# Altium schematic sheet CW340_SAM3X_MAIN.SchDoc: Control MCU Main
size Letter; Organization: NewAE Technology Inc.; Address1: 1083 Queen St., Suite 196; Address2: Halifax; Address3: NS; Address4: Canada B3H 0B2; DocumentNumber: .; Revision: .; SheetNumber: 5; SheetTotal: 31; SheetApproved: No
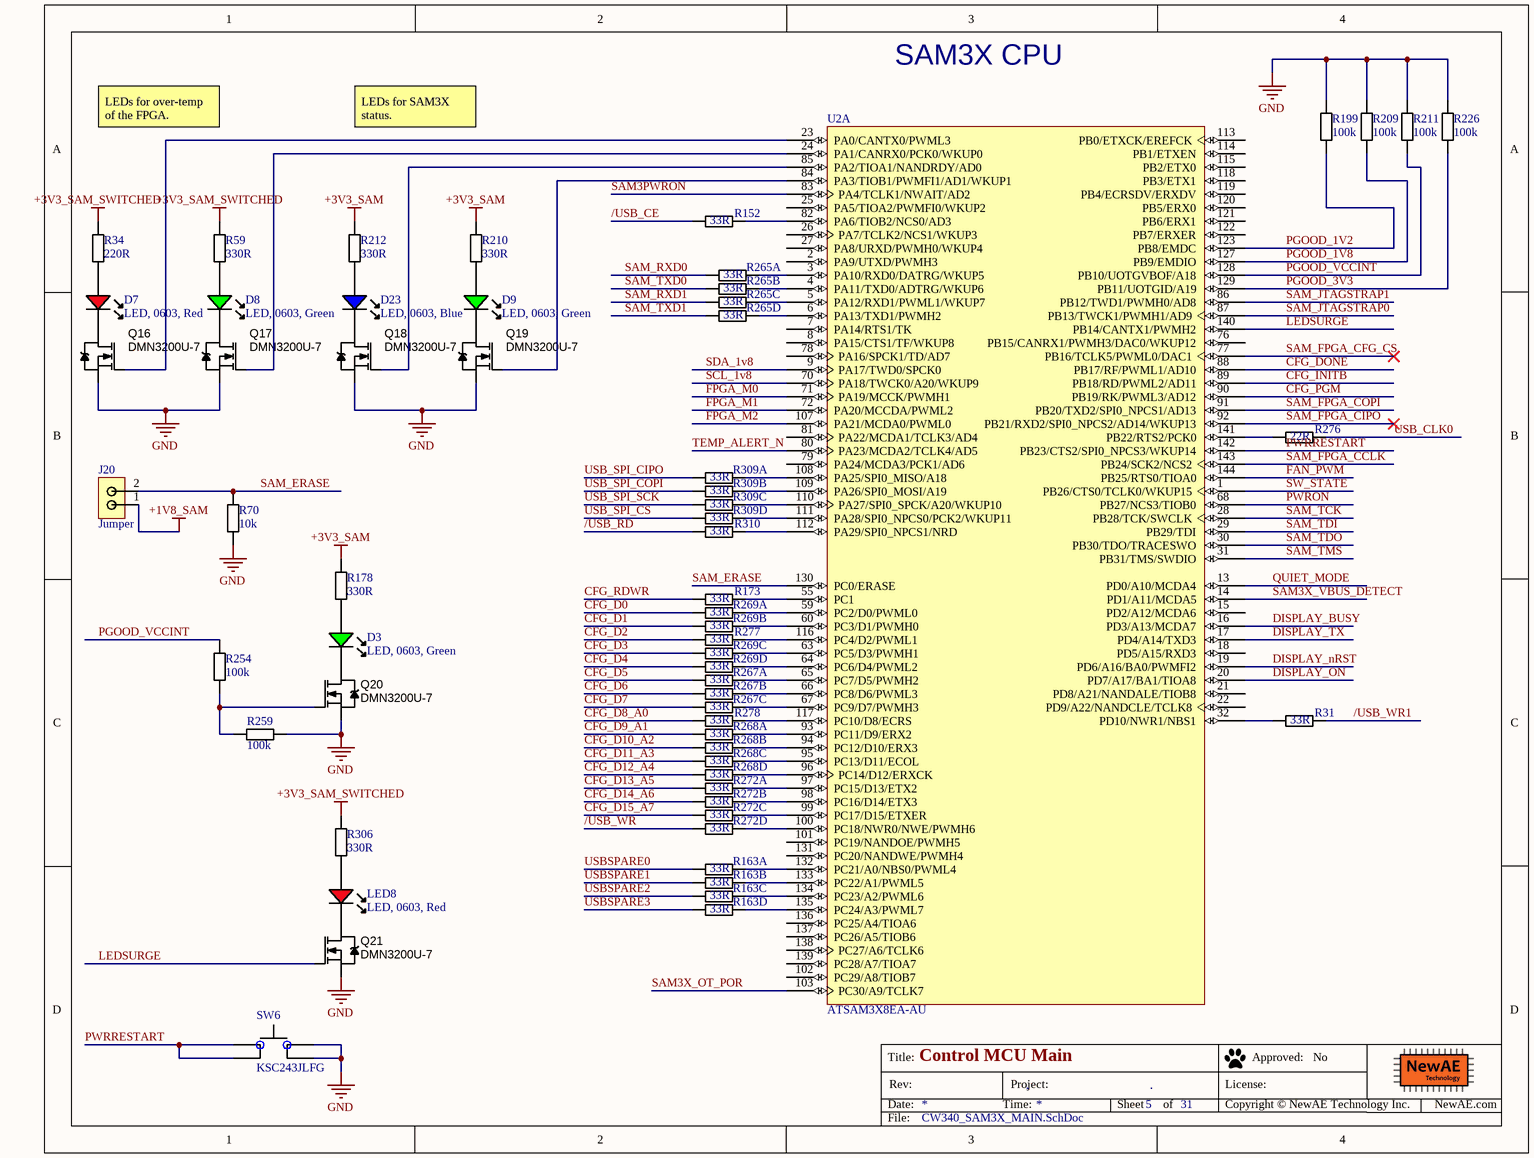
[diagram p0: CW340_SAM3X_MAIN.SchDoc]

## Parts
D3  LED, 0603, Green  [LED-0603-GREEN]
D7  LED, 0603, Red  [LED-0603-RED]
D8  LED, 0603, Green  [LED-0603-GREEN]
D9  LED, 0603, Green  [LED-0603-GREEN]
D23  LED, 0603, Blue  [LED-0603-BLUE]
J20  Jumper  [2x2.54mm_Header]
LED8  LED, 0603, Red  [LED-0603-RED]
Q16  DMN3200U-7  [SOT95P245X110-3M]
Q17  DMN3200U-7  [SOT95P245X110-3M]
Q18  DMN3200U-7  [SOT95P245X110-3M]
Q19  DMN3200U-7  [SOT95P245X110-3M]
Q20  DMN3200U-7  [SOT95P245X110-3M]
Q21  DMN3200U-7  [SOT95P245X110-3M]
R31  33R  [RESC1005X40N]
R34  220R  [RESC1608X55N]
R59  330R  [RESC1608X55N]
R70  10k  [RESC1005X40N]
R152  33R  [RESC1005X40N]
R163  33R  [741C083]  (parts A,B,C,D of 4)
R173  33R  [RESC1005X40N]
R178  330R  [RESC1608X55N]
R199  100k  [RESC1608X55N]
R209  100k  [RESC1608X55N]
R210  330R  [RESC1608X55N]
R211  100k  [RESC1608X55N]
R212  330R  [RESC1608X55N]
R226  100k  [RESC1608X55N]
R254  100k  [RESC1608X55N]
R259  100k  [RESC1608X55N]
R265  33R  [741C083]  (parts A,B,C,D of 4)
R267  33R  [741C083]  (parts A,B,C of 4)
R268  33R  [741C083]  (parts A,B,C,D of 4)
R269  33R  [741C083]  (parts A,B,C,D of 4)
R272  33R  [741C083]  (parts A,B,C,D of 4)
R276  22R  [RESC1005X40N]
R277  33R  [RESC1005X40N]
R278  33R  [RESC1005X40N]
R306  330R  [RESC1608X55N]
R309  33R  [741C083]  (parts A,B,C,D of 4)
R310  33R  [RESC1005X40N]
SW6  KSC243JLFG  [CK_KSC2J]
U2  ATSAM3X8EA-AU  [LQFP144_L]  (part A of 3)

## Nets
+1V8_SAM: J20.1
+3V3_SAM: R178.2 R210.2 R212.2
+3V3_SAM_SWITCHED: R34.2 R59.2 R306.2
GND: Q16.2(S) Q17.2(S) Q18.2(S) Q19.2(S) Q20.2(S) Q21.2(S) R70.2 R199.1 R209.1 R211.1 R226.1 R259.2 SW6.2(IN) SW6.3(IN)
/USB_CE: R152.1
/USB_RD: R310.1
/USB_WR: R272.4A
/USB_WR1: R31.2
CFG_D0: R269.1A
CFG_D1: R269.2A
CFG_D2: R277.1
CFG_D3: R269.3A
CFG_D4: R269.4A
CFG_D5: R267.1A
CFG_D6: R267.2A
CFG_D7: R267.3A
CFG_D8_A0: R278.1
CFG_D9_A1: R268.1A
CFG_D10_A2: R268.2A
CFG_D11_A3: R268.3A
CFG_D12_A4: R268.4A
CFG_D13_A5: R272.1A
CFG_D14_A6: R272.2A
CFG_D15_A7: R272.3A
CFG_DONE: U2.88(PB17/RF/PWML1/AD10)
CFG_INITB: U2.89(PB18/RD/PWML2/AD11)
CFG_PGM: U2.90(PB19/RK/PWML3/AD12)
CFG_RDWR: R173.1
DISPLAY_BUSY: U2.16(PD3/A13/MCDA7)
DISPLAY_nRST: U2.19(PD6/A16/BA0/PWMFI2)
DISPLAY_ON: U2.20(PD7/A17/BA1/TIOA8)
DISPLAY_TX: U2.17(PD4/A14/TXD3)
FAN_PWM: U2.144(PB25/RTS0/TIOA0)
FPGA_M0: U2.71(PA19/MCCK/PWMH1)
FPGA_M1: U2.72(PA20/MCCDA/PWML2)
FPGA_M2: U2.107(PA21/MCDA0/PWML0)
LEDSURGE: Q21.1(G) U2.140(PB14/CANTX1/PWMH2)
PGOOD_1V2: R199.2 U2.123(PB8/EMDC)
PGOOD_1V8: R209.2 U2.127(PB9/EMDIO)
PGOOD_3V3: R226.2 U2.129(PB11/UOTGID/A19)
PGOOD_VCCINT: R211.2 R254.1 U2.128(PB10/UOTGVBOF/A18)
PWRON: U2.68(PB27/NCS3/TIOB0)
PWRRESTART: SW6.1(IN) SW6.4(IN) U2.142(PB23/CTS2/SPI0_NPCS3/WKUP14)
QUIET_MODE: U2.13(PD0/A10/MCDA4)
SAM3PWRON: U2.83(PA4/TCLK1/NWAIT/AD2)
SAM3X_OT_POR: U2.103(PC30/A9/TCLK7)
SAM3X_VBUS_DETECT: U2.14(PD1/A11/MCDA5)
SAM_ERASE: J20.2 R70.1 U2.130(PC0/ERASE)
SAM_FPGA_CCLK: U2.143(PB24/SCK2/NCS2)
SAM_FPGA_CFG_CS: U2.77(PB16/TCLK5/PWML0/DAC1)
SAM_FPGA_CIPO: U2.92(PB21/RXD2/SPI0_NPCS2/AD14/WKUP13)
SAM_FPGA_COPI: U2.91(PB20/TXD2/SPI0_NPCS1/AD13)
SAM_JTAGSTRAP0: U2.87(PB13/TWCK1/PWMH1/AD9)
SAM_JTAGSTRAP1: U2.86(PB12/TWD1/PWMH0/AD8)
SAM_RXD0: R265.1A
SAM_RXD1: R265.3A
SAM_TCK: U2.28(PB28/TCK/SWCLK)
SAM_TDI: U2.29(PB29/TDI)
SAM_TDO: U2.30(PB30/TDO/TRACESWO)
SAM_TMS: U2.31(PB31/TMS/SWDIO)
SAM_TXD0: R265.2A
SAM_TXD1: R265.4A
SCL_1v8: U2.70(PA18/TWCK0/A20/WKUP9)
SDA_1v8: U2.9(PA17/TWD0/SPCK0)
SW_STATE: U2.1(PB26/CTS0/TCLK0/WKUP15)
TEMP_ALERT_N: U2.80(PA23/MCDA2/TCLK4/AD5)
USB_CLK0: R276.2
USB_SPI_CIPO: R309.1A
USB_SPI_COPI: R309.2A
USB_SPI_CS: R309.4A
USB_SPI_SCK: R309.3A
USBSPARE0: R163.1A
USBSPARE1: R163.2A
USBSPARE2: R163.3A
USBSPARE3: R163.4A
NetD3_A: D3.A R178.1
NetD3_K: D3.K Q20.3(D)
NetD7_A: D7.A R34.1
NetD7_K: D7.K Q16.3(D)
NetD8_A: D8.A R59.1
NetD8_K: D8.K Q17.3(D)
NetD9_A: D9.A R210.1
NetD9_K: D9.K Q19.3(D)
NetD23_A: D23.A R212.1
NetD23_K: D23.K Q18.3(D)
NetLED8_A: LED8.A R306.1
NetLED8_K: LED8.K Q21.3(D)
NetQ16_1: Q16.1(G) U2.23(PA0/CANTX0/PWML3)
NetQ17_1: Q17.1(G) U2.24(PA1/CANRX0/PCK0/WKUP0)
NetQ18_1: Q18.1(G) U2.85(PA2/TIOA1/NANDRDY/AD0)
NetQ19_1: Q19.1(G) U2.84(PA3/TIOB1/PWMFI1/AD1/WKUP1)
NetQ20_1: Q20.1(G) R254.2 R259.1
NetR31_1: R31.1 U2.32(PD10/NWR1/NBS1)
NetR152_2: R152.2 U2.82(PA6/TIOB2/NCS0/AD3)
NetR163_1B: R163.1B U2.132(PC21/A0/NBS0/PWML4)
NetR163_2B: R163.2B U2.133(PC22/A1/PWML5)
NetR163_3B: R163.3B U2.134(PC23/A2/PWML6)
NetR163_4B: R163.4B U2.135(PC24/A3/PWML7)
NetR173_2: R173.2 U2.55(PC1)
NetR265_1B: R265.1B U2.3(PA10/RXD0/DATRG/WKUP5)
NetR265_2B: R265.2B U2.4(PA11/TXD0/ADTRG/WKUP6)
NetR265_3B: R265.3B U2.5(PA12/RXD1/PWML1/WKUP7)
NetR265_4B: R265.4B U2.6(PA13/TXD1/PWMH2)
NetR267_1B: R267.1B U2.65(PC7/D5/PWMH2)
NetR267_2B: R267.2B U2.66(PC8/D6/PWML3)
NetR267_3B: R267.3B U2.67(PC9/D7/PWMH3)
NetR268_1B: R268.1B U2.93(PC11/D9/ERX2)
NetR268_2B: R268.2B U2.94(PC12/D10/ERX3)
NetR268_3B: R268.3B U2.95(PC13/D11/ECOL)
NetR268_4B: R268.4B U2.96(PC14/D12/ERXCK)
NetR269_1B: R269.1B U2.59(PC2/D0/PWML0)
NetR269_2B: R269.2B U2.60(PC3/D1/PWMH0)
NetR269_3B: R269.3B U2.63(PC5/D3/PWMH1)
NetR269_4B: R269.4B U2.64(PC6/D4/PWML2)
NetR272_1B: R272.1B U2.97(PC15/D13/ETX2)
NetR272_2B: R272.2B U2.98(PC16/D14/ETX3)
NetR272_3B: R272.3B U2.99(PC17/D15/ETXER)
NetR272_4B: R272.4B U2.100(PC18/NWR0/NWE/PWMH6)
NetR276_1: R276.1 U2.141(PB22/RTS2/PCK0)
NetR277_2: R277.2 U2.116(PC4/D2/PWML1)
NetR278_2: R278.2 U2.117(PC10/D8/ECRS)
NetR309_1B: R309.1B U2.108(PA25/SPI0_MISO/A18)
NetR309_2B: R309.2B U2.109(PA26/SPI0_MOSI/A19)
NetR309_3B: R309.3B U2.110(PA27/SPI0_SPCK/A20/WKUP10)
NetR309_4B: R309.4B U2.111(PA28/SPI0_NPCS0/PCK2/WKUP11)
NetR310_2: R310.2 U2.112(PA29/SPI0_NPCS1/NRD)

Not connected (* = marked no-connect by the designer): U2 2(PA9/UTXD/PWMH3) 7(PA14/RTS1/TK) 8(PA15/CTS1/TF/WKUP8) 15(PD2/A12/MCDA6) 18(PD5/A15/RXD3) 21(PD8/A21/NANDALE/TIOB8) 22(PD9/A22/NANDCLE/TCLK8) 25(PA5/TIOA2/PWMFI0/WKUP2) 26(PA7/TCLK2/NCS1/WKUP3) 27(PA8/URXD/PWMH0/WKUP4) 76(PB15/CANRX1/PWMH3/DAC0/WKUP12) 78(PA16/SPCK1/TD/AD7) 79(PA24/MCDA3/PCK1/AD6) 81(PA22/MCDA1/TCLK3/AD4) 101(PC19/NANDOE/PWMH5) 102(PC29/A8/TIOB7) 113(PB0/ETXCK/EREFCK) 114(PB1/ETXEN) 115(PB2/ETX0) 118(PB3/ETX1) 119(PB4/ECRSDV/ERXDV) 120(PB5/ERX0) 121(PB6/ERX1) 122(PB7/ERXER) 131(PC20/NANDWE/PWMH4) 136(PC25/A4/TIOA6) 137(PC26/A5/TIOB6) 138(PC27/A6/TCLK6) 139(PC28/A7/TIOA7)

## Notes on the sheet
- SAM3X CPU
- LEDs for over-temp of the FPGA.
- LEDs for SAM3X status.
- Title:
- Date:
- Rev:
- Time:
- Project:
- Sheet
- of
- License:
- Copyright © NewAE Technology Inc.
- Approved:
- NewAE.com
- File:

## Library data of the parts
D3 D8 D9 = LEDCHIP_0603_GREEN: Chip LED, Green; Manufacture 1: Kingbright; Manufacture Part Number 1: APT1608CGCK; Component Group: Optical; PP Material Stack: 16; PP Rotation: -90; Part Number: LEDCHIP_0603_GREEN; Pin Count: 2; Supplier 1: Digi-Key; Supplier Part Number 1: 754-1116-1-ND; Mounting Technology: SMT; Component Kind: Standard; Component Type: Standard
D7 LED8 = LEDCHIP_0603_RED: Chip LED, Red; Manufacture 1: Kingbright; Manufacture Part Number 1: APT1608SRCPRV; Component Group: Optical; PP Material Stack: 15; PP Rotation: -90; Part Number: LEDCHIP_0603_RED; Pin Count: 2; Supplier 1: Digi-Key; Supplier Part Number 1: 754-1122-1-ND; Mounting Technology: SMT; Component Kind: Standard; Component Type: Standard
D23 = LEDCHIP_0603_BLUE: Chip LED, Blue; Manufacture 1: Kingbright; Manufacture Part Number 1: APT1608QBC/D; Component Group: Optical; Part Number: LEDCHIP_0603_BLUE; Pin Count: 2; Mounting Technology: SMT; Component Kind: Standard; Component Type: Standard
J20 = 2_PIN_JUMPER: 1x2 2.54mm header, male pins; Manufacture 1: Harwin; Manufacture Part Number 1: M20-9990246; Component Group: PCB Feature; PP Material Stack: 0; Part Number: 2_PIN_JUMPER; Pin Count: 2; Supplier 1: Digi-Key; Supplier Part Number 1: 952-2262-ND; Mounting Technology: Through-hole; RoHS: Yes; Component Kind: Standard; Component Type: Standard; PP Rotation: 0
Q16-Q21 = DMN3200U-7: MOSFET N-CH 30V 2.2A SOT23-3; Manufacture 1: Diodes Inc.; Rated Power: 3A; PP Material Stack: 0; Part Number: DMN3200U-7; Component Group: MOSFET; Footprint: SOT23; Manufacture Part Number 1: DMN3200U-7; Pin Count: 3; Supplier 1: Digi-Key; Supplier Part Number 1: DMN3200U-7DICT-ND; Rated Voltage: 30V; Mounting Technology: SMT; RoHS: Yes; Component Kind: Standard; Component Type: Standard; PP Rotation: 0
R31 R152 R173 R277 R278 R310 = RCHIP-33R-0402: 33R res, 0402, 1%, 1/16W; Manufacture 1: Yageo; Manufacture Part Number 1: RC0402FR-0733RL; Component Group: Resistor; Case-EIA: 0402; Case-Metric: 1005; Rated Power: 0.063W; Rated Voltage: 75VDC; Part Number: RCHIP-33R-0402; Footprint: 0402; Pin Count: 2; Supplier 1: Digi-Key; Supplier Part Number 1: 311-33.0LRCT-ND; Value: 33R; Tolerance: 1%; Mounting Technology: SMT; Temperature Range: -55C to 155C; Component Kind: Standard; Component Type: Standard
R34 = RCHIP-220R-0603: 220R res, 0603, 1%, 1/10W; Manufacture 1: Yageo; Manufacture Part Number 1: RC0603FR-07220RL; Component Group: Resistor; Case-EIA: 0603; Case-Metric: 1608; Rated Power: 0.1W; Rated Voltage: 75VDC; Part Number: RCHIP-220R-0603; Footprint: 0603; Pin Count: 2; Supplier 1: Digi-Key; Supplier Part Number 1: 311-220HRCT-ND; Value: 220R; Tolerance: 1%; Mounting Technology: SMT; Temperature Range: -55C to 155C; Component Kind: Standard; Component Type: Standard
R59 R178 R210 R212 R306 = RCHIP-330R-0603: 330R res, 0603, 1%, 1/10W; Manufacture 1: Yageo; Manufacture Part Number 1: RC0603FR-07330RL; Component Group: Resistor; Case-EIA: 0603; Case-Metric: 1608; Rated Power: 0.1W; Rated Voltage: 75VDC; Part Number: RCHIP-330R-0603; Footprint: 0603; Pin Count: 2; Supplier 1: Digi-Key; Supplier Part Number 1: 311-330HRCT-ND; Value: 330R; Tolerance: 1%; Mounting Technology: SMT; Temperature Range: -55C to 155C; Component Kind: Standard; Component Type: Standard
R70 = RCHIP-10K-0402: 10k res, 0402, 1%, 1/16W; Manufacture 1: Yageo; Manufacture Part Number 1: RC0402FR-0710KL; Component Group: Resistor; Case-EIA: 0402; Case-Metric: 1005; Rated Power: 0.063W; Rated Voltage: 75VDC; Part Number: RCHIP-10K-0402; Footprint: 0402; Pin Count: 2; Supplier 1: Digi-Key; Supplier Part Number 1: 311-10.0KLRCT-ND; Value: 10k; Tolerance: 1%; Mounting Technology: SMT; Temperature Range: -55C to 155C; Component Kind: Standard; Component Type: Standard
R163 R265 R267-R269 R272 R309 = 741C083330JP: 33-ohm, 0.5mm res array; Manufacture 1: CTS; Component Group: Resistor; PP Material Stack: 0; Part Number: 741C083330JP; Manufacture Part Number 1: 741C083330JP; Pin Count: 8; Supplier 1: Digi-Key; Mounting Technology: SMT; Component Kind: Standard; Component Type: Standard; PP Rotation: 0; PP Rotation1: 0; Supplier Part Number 1: 741C083330JPCT-ND
R199 R209 R211 R226 R254 R259 = RCHIP-100K-0603: 100k res, 0603, 1%, 1/10W; Manufacture 1: Yageo; Manufacture Part Number 1: RC0603FR-07100KL; Component Group: Resistor; Case-EIA: 0603; Case-Metric: 1608; Rated Power: 0.1W; Rated Voltage: 75VDC; Part Number: RCHIP-100K-0603; Footprint: 0603; Pin Count: 2; Supplier 1: Digi-Key; Supplier Part Number 1: 311-100KHRCT-ND; Value: 100k; Tolerance: 1%; Mounting Technology: SMT; Temperature Range: -55C to 155C; Component Kind: Standard; Component Type: Standard
R276 = RCHIP-22R-0402: 22R res, 0402, 1%, 1/16W; Manufacture 1: Yageo; Manufacture Part Number 1: RC0402FR-0722RL; Component Group: Resistor; Case-EIA: 0402; Case-Metric: 1005; Rated Power: 0.063W; Rated Voltage: 75VDC; Part Number: RCHIP-22R-0402; Footprint: 0402; Pin Count: 2; Supplier 1: Digi-Key; Supplier Part Number 1: 311-22.0LRCT-ND; Value: 22R; Tolerance: 1%; Mounting Technology: SMT; Temperature Range: -55C to 155C; Component Kind: Standard; Component Type: Standard
SW6 = TACTSW-KSC243J: SWITCH TACTILE SPST-NO 0.01A 32V; Manufacture 1: C&K; Part Number: TACTSW-KSC243J; Component Group: Switch; Manufacture Part Number 1: KSC243JLFG; Pin Count: 4; Supplier 1: Digi-Key; Supplier Part Number 1: 401-1764-1-ND; Mounting Technology: SMT; RoHS: Yes; Component Kind: Standard; Component Type: Standard
U2 = CMP-0076-00188-1: SAM3X ARM Cortex-M3 Flash-based Microcontroller, 512 KB Flash, 96 KB SRAM, 103 User I/Os, 1.62 to 3.6 V, -40 to 85 degC, 144-Pin LQFP, RoHS; Manufacturer: Atmel; UART: 5; Max. Operating Freq.: 84 MHz; ADC Resolution: 12 bits; Flash: 512 Kbytes; ADC Channels: 16; SRAM: 96 Kbytes; Max I/O Pins: 103; DAC Channels: 2; SPI: 4; # of Touch Channels: 32; Mounting Technology: Surface Mount; Operating Voltage: 1.62 to 3.6 V; ComponentLink2URL: http://www.atmel.com/Images/doc11057.pdf; CAN: 2; ComponentLink1Description: Manufacturer URL; RoHS: TRUE; PartNumber: ATSAM3X8EA-AU; Temp. Range: -40 to 85 degC; PackageVersion: 11057B; PackageDescription: 100-Pin Quad Flat Package, Body 20 x 20 mm, Pitch 0.5 mm; ComponentLink2Description: Datasheet; DatasheetVersion: 11057B; ComponentLink1URL: http://www.atmel.com/; ComponentLink3Description: Package Specification; ComponentLink3URL: http://www.atmel.com/Images/doc11057.pdf; PackageReference: LQFP-144